# Altium project MU-RK3576J-MB.PrjPCB (part 11 of 13)

## Sheet RGMII0_ETH_PHY.SchDoc
size 420 x 297 mm; SheetNumber: 16; SheetTotal: 32; DocumentTypeShort: Э3; DocumentInvertoryNumber: ㅤ
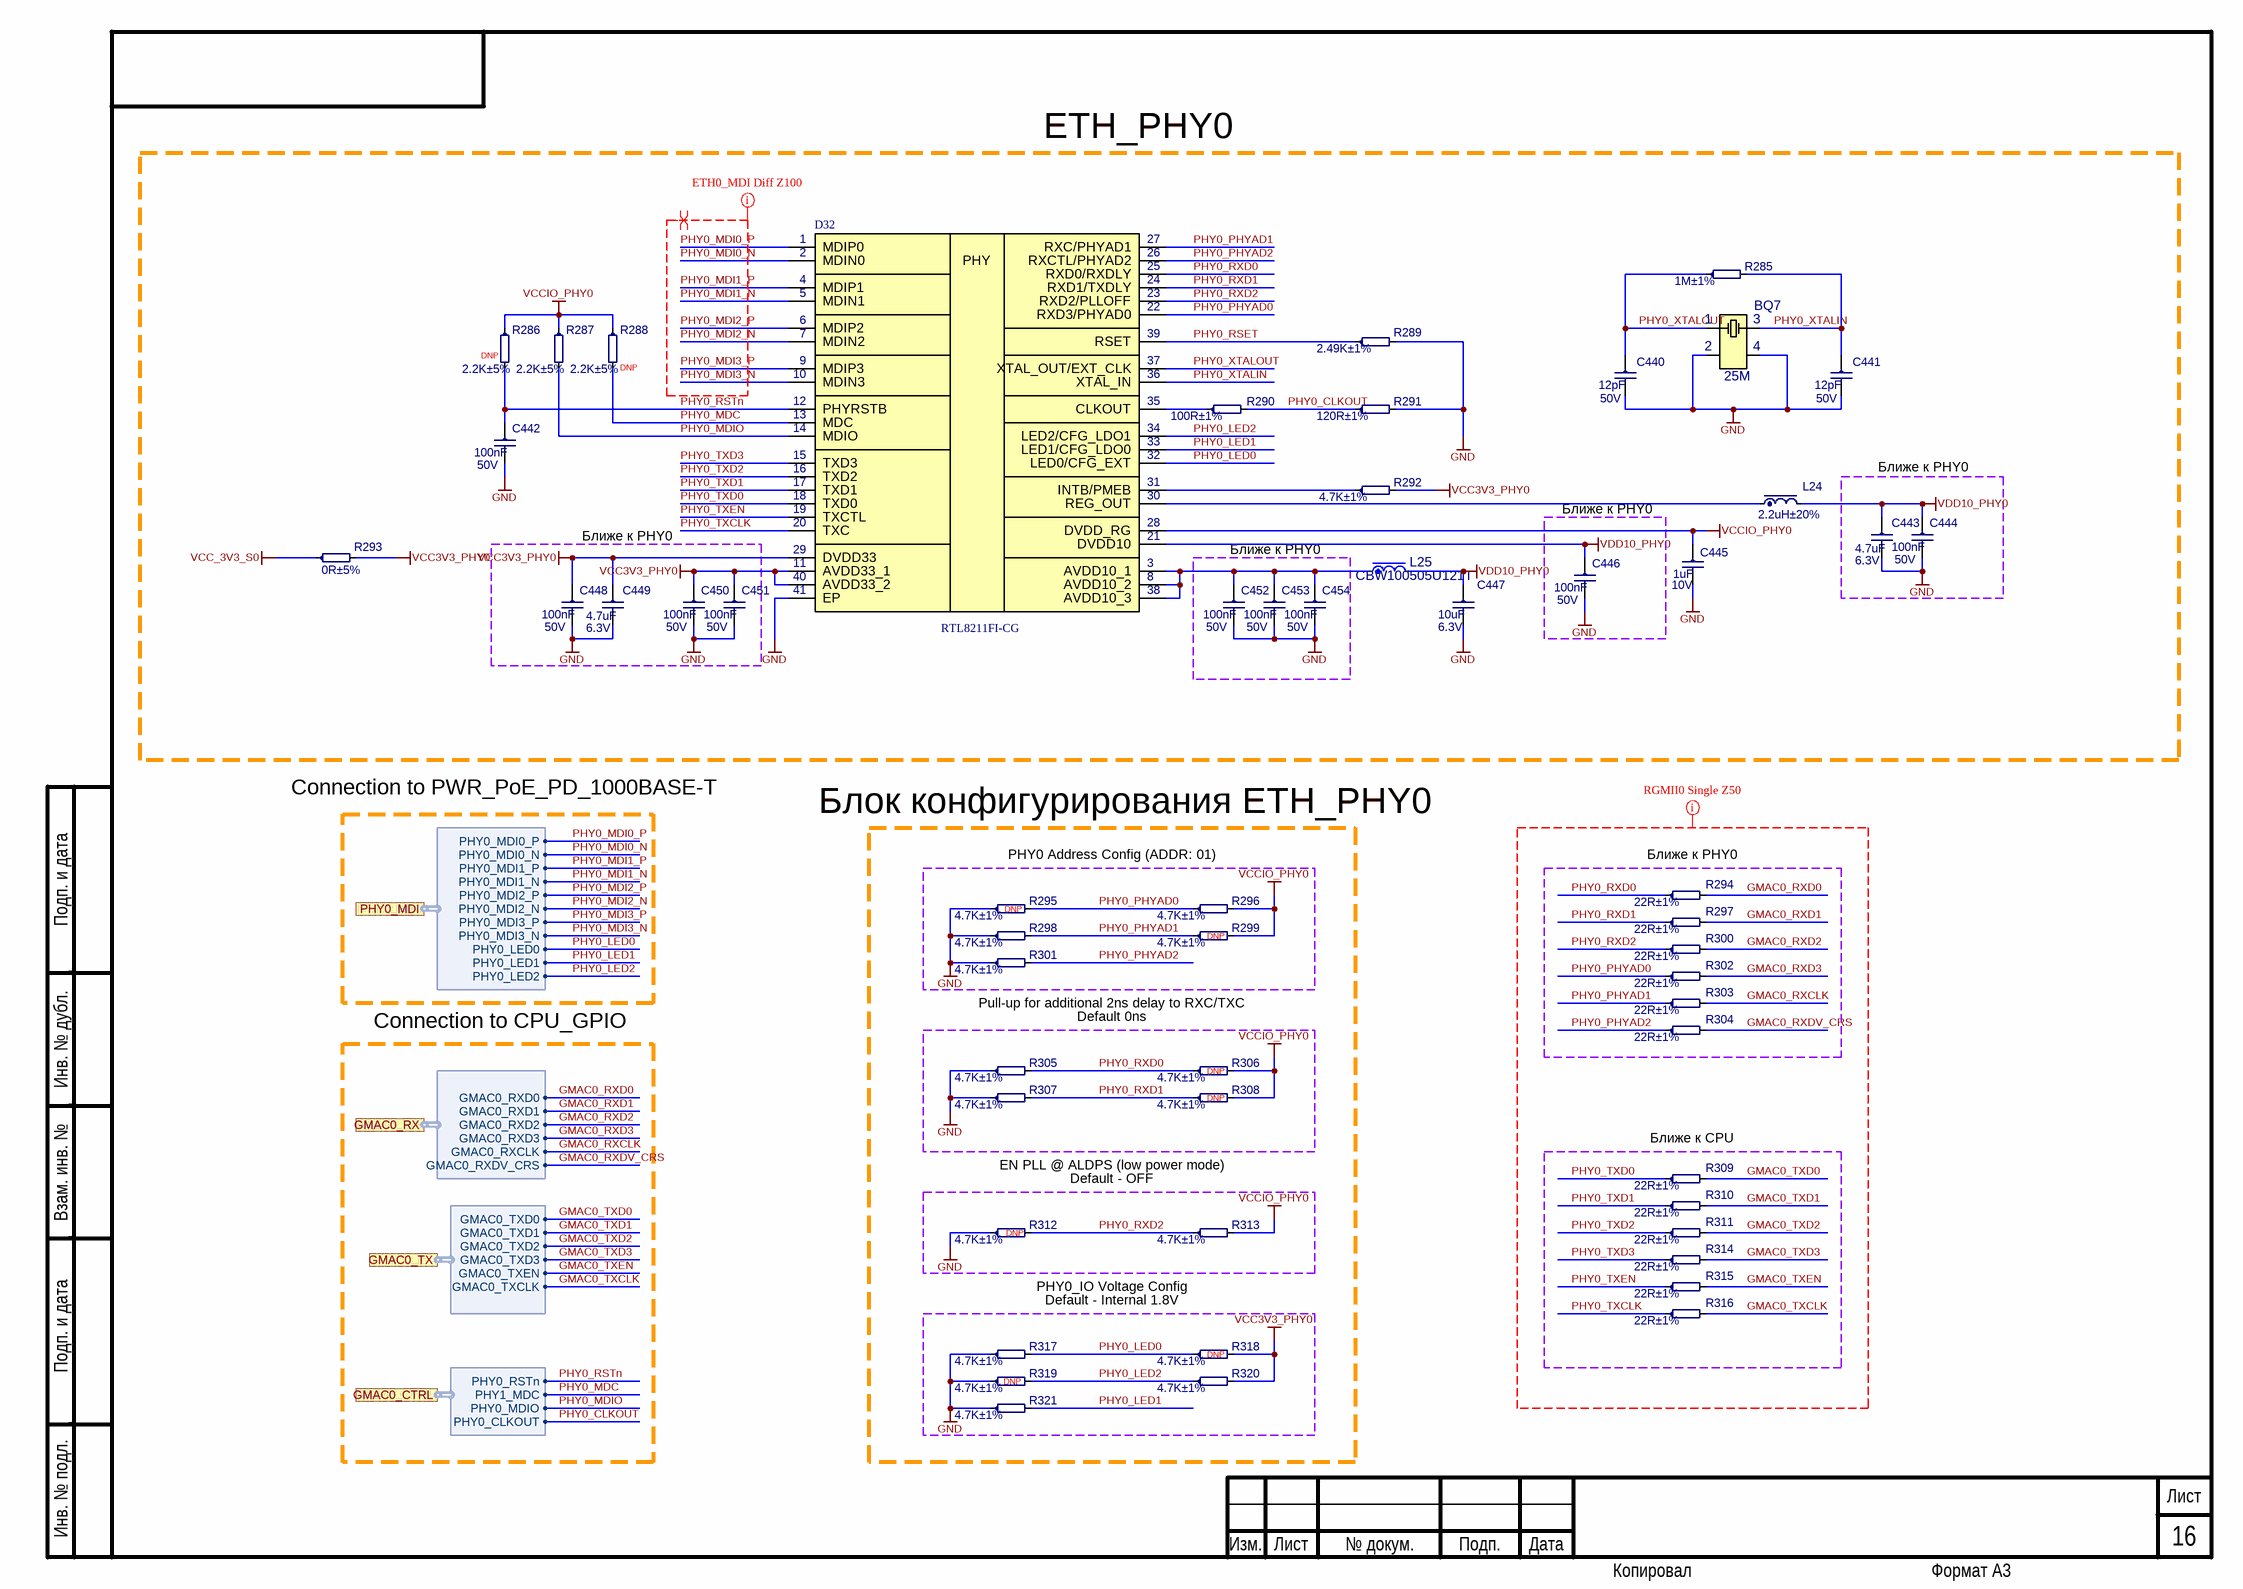
[diagram p31: RGMII0_ETH_PHY.SchDoc]

### Parts
BQ7  25M  [NX3225GA]
C440  12pF  Voltage: 50V  [C0402]
C441  12pF  Voltage: 50V  [C0402]
C442  100nF  Voltage: 50V  [C0402]
C443  4.7uF  Voltage: 6.3V  [C0402]
C444  100nF  Voltage: 50V  [C0402]
C445  1uF  Voltage: 10V  [C0402]
C446  100nF  Voltage: 50V  [C0402]
C447  10uF  Voltage: 6.3V  [C0402]
C448  100nF  Voltage: 50V  [C0402]
C449  4.7uF  Voltage: 6.3V  [C0402]
C450  100nF  Voltage: 50V  [C0402]
C451  100nF  Voltage: 50V  [C0402]
C452  100nF  Voltage: 50V  [C0402]
C453  100nF  Voltage: 50V  [C0402]
C454  100nF  Voltage: 50V  [C0402]
D32  RTL8211FI-CG  [RTL8211F-CG]
L24  2.2uH±20%  [L0806]
L25  CBW100505U121T  [L0402]
R285  1M±1%  [R0402]
R286  2.2K±5%  [R0402]
R287  2.2K±5%  [R0402]
R288  2.2K±5%  [R0402]
R289  2.49K±1%  [R0402]
R290  100R±1%  [R0402]
R291  120R±1%  [R0402]
R292  4.7K±1%  [R0402]
R293  0R±5%  [R0805]
R294  22R±1%  [R0402]
R295  4.7K±1%  [R0402]
R296  4.7K±1%  [R0402]
R297  22R±1%  [R0402]
R298  4.7K±1%  [R0402]
R299  4.7K±1%  [R0402]
R300  22R±1%  [R0402]
R301  4.7K±1%  [R0402]
R302  22R±1%  [R0402]
R303  22R±1%  [R0402]
R304  22R±1%  [R0402]
R305  4.7K±1%  [R0402]
R306  4.7K±1%  [R0402]
R307  4.7K±1%  [R0402]
R308  4.7K±1%  [R0402]
R309  22R±1%  [R0402]
R310  22R±1%  [R0402]
R311  22R±1%  [R0402]
R312  4.7K±1%  [R0402]
R313  4.7K±1%  [R0402]
R314  22R±1%  [R0402]
R315  22R±1%  [R0402]
R316  22R±1%  [R0402]
R317  4.7K±1%  [R0402]
R318  4.7K±1%  [R0402]
R319  4.7K±1%  [R0402]
R320  4.7K±1%  [R0402]
R321  4.7K±1%  [R0402]

### Blocks framed on the sheet
Ближе к PHY0: C446
Ближе к PHY0: C443 C444
Ближе к PHY0: C448-C451
Ближе к PHY0: C452-C454
PHY0 Address Config (ADDR: 01): R295 R296 R298 R299 R301
Ближе к PHY0: R294 R297 R300 R302-R304
Default 0ns: R305-R308
Ближе к CPU: R309-R311 R314-R316
Default - OFF: R312 R313
Default - Internal 1.8V: R317-R321

### Ports
GMAC0_CTRL (harness GMAC0_CTRL), GMAC0_RX (harness GMAC0_RX), GMAC0_TX (harness GMAC0_TX), PHY0_MDI (harness PHY0_MDI)

### Harnesses
GMAC0_RX: GMAC0_RXD1, GMAC0_RXD2, GMAC0_RXD3, GMAC0_RXD0, GMAC0_RXCLK, GMAC0_RXDV_CRS
GMAC0_TX: GMAC0_TXD1, GMAC0_TXD2, GMAC0_TXD3, GMAC0_TXD0, GMAC0_TXEN, GMAC0_TXCLK
GMAC0_CTRL: PHY0_RSTn, PHY1_MDC, PHY0_MDIO, PHY0_CLKOUT
PHY0_MDI: PHY0_MDI0_N, PHY0_MDI1_P, PHY0_MDI1_N, PHY0_MDI2_P, PHY0_MDI0_P, PHY0_MDI2_N, PHY0_MDI3_P, PHY0_MDI3_N, PHY0_LED0, PHY0_LED1, PHY0_LED2

### Nets
GND: BQ7.2 BQ7.4 C440.2 C441.2 C442.2 C443.2 C444.2 C445.2 C446.2 C447.2 C448.2 C449.2 C450.2 C451.2 C452.2 C453.2 C454.2 D32.41(EP) R289.2 R291.2 R295.1 R298.1 R301.1 R305.1 R307.1 R312.1 R317.1 R319.1 R321.1
VCC3V3_PHY0: C448.1 C449.1 C450.1 C451.1 D32.11(AVDD33_1) D32.29(DVDD33) D32.40(AVDD33_2) R292.2 R293.2 R318.2 R320.2
VCC_3V3_S0: R293.1
VCCIO_PHY0: C445.1 D32.28(DVDD_RG) R286.1 R287.1 R288.1 R296.2 R299.2 R306.2 R308.2 R313.2
VDD10_PHY0: C443.1 C444.1 C446.1 C447.1 D32.21(DVDD10) L24.2 L25.2
GMAC0_RXCLK: R303.2 ; port GMAC0_RX.GMAC0_RXCLK
GMAC0_RXD0: R294.2 ; port GMAC0_RX.GMAC0_RXD0
GMAC0_RXD1: R297.2 ; port GMAC0_RX.GMAC0_RXD1
GMAC0_RXD2: R300.2 ; port GMAC0_RX.GMAC0_RXD2
GMAC0_RXD3: R302.2 ; port GMAC0_RX.GMAC0_RXD3
GMAC0_RXDV_CRS: R304.2 ; port GMAC0_RX.GMAC0_RXDV_CRS
GMAC0_TXCLK: R316.2 ; port GMAC0_TX.GMAC0_TXCLK
GMAC0_TXD0: R309.2 ; port GMAC0_TX.GMAC0_TXD0
GMAC0_TXD1: R310.2 ; port GMAC0_TX.GMAC0_TXD1
GMAC0_TXD2: R311.2 ; port GMAC0_TX.GMAC0_TXD2
GMAC0_TXD3: R314.2 ; port GMAC0_TX.GMAC0_TXD3
GMAC0_TXEN: R315.2 ; port GMAC0_TX.GMAC0_TXEN
PHY0_CLKOUT: R290.2 R291.1 ; port GMAC0_CTRL.PHY0_CLKOUT
PHY0_LED0: D32.32(LED0/CFG_EXT) R317.2 R318.1 ; port PHY0_MDI.PHY0_LED0
PHY0_LED1: D32.33(LED1/CFG_LDO0) R321.2 ; port PHY0_MDI.PHY0_LED1
PHY0_LED2: D32.34(LED2/CFG_LDO1) R319.2 R320.1 ; port PHY0_MDI.PHY0_LED2
PHY0_MDC: D32.13(MDC) R288.2 ; port GMAC0_CTRL.PHY1_MDC
PHY0_MDI0_N: D32.2(MDIN0) ; port PHY0_MDI.PHY0_MDI0_N  [project net PHY0_MDI.PHY0_MDI0_N]
PHY0_MDI0_P: D32.1(MDIP0) ; port PHY0_MDI.PHY0_MDI0_P  [project net PHY0_MDI.PHY0_MDI0_P]
PHY0_MDI1_N: D32.5(MDIN1) ; port PHY0_MDI.PHY0_MDI1_N  [project net PHY0_MDI.PHY0_MDI1_N]
PHY0_MDI1_P: D32.4(MDIP1) ; port PHY0_MDI.PHY0_MDI1_P  [project net PHY0_MDI.PHY0_MDI1_P]
PHY0_MDI2_N: D32.7(MDIN2) ; port PHY0_MDI.PHY0_MDI2_N  [project net PHY0_MDI.PHY0_MDI2_N]
PHY0_MDI2_P: D32.6(MDIP2) ; port PHY0_MDI.PHY0_MDI2_P  [project net PHY0_MDI.PHY0_MDI2_P]
PHY0_MDI3_N: D32.10(MDIN3) ; port PHY0_MDI.PHY0_MDI3_N  [project net PHY0_MDI.PHY0_MDI3_N]
PHY0_MDI3_P: D32.9(MDIP3) ; port PHY0_MDI.PHY0_MDI3_P  [project net PHY0_MDI.PHY0_MDI3_P]
PHY0_MDIO: D32.14(MDIO) R287.2 ; port GMAC0_CTRL.PHY0_MDIO
PHY0_PHYAD0: D32.22(RXD3/PHYAD0) R295.2 R296.1 R302.1
PHY0_PHYAD1: D32.27(RXC/PHYAD1) R298.2 R299.1 R303.1
PHY0_PHYAD2: D32.26(RXCTL/PHYAD2) R301.2 R304.1
PHY0_RSET: D32.39(RSET) R289.1
PHY0_RSTn: C442.1 D32.12(PHYRSTB) R286.2 ; port GMAC0_CTRL.PHY0_RSTn
PHY0_RXD0: D32.25(RXD0/RXDLY) R294.1 R305.2 R306.1
PHY0_RXD1: D32.24(RXD1/TXDLY) R297.1 R307.2 R308.1
PHY0_RXD2: D32.23(RXD2/PLLOFF) R300.1 R312.2 R313.1
PHY0_TXCLK: D32.20(TXC) R316.1
PHY0_TXD0: D32.18(TXD0) R309.1
PHY0_TXD1: D32.17(TXD1) R310.1
PHY0_TXD2: D32.16(TXD2) R311.1
PHY0_TXD3: D32.15(TXD3) R314.1
PHY0_TXEN: D32.19(TXCTL) R315.1
PHY0_XTALIN: BQ7.3 C441.1 D32.36(XTAL_IN) R285.2
PHY0_XTALOUT: BQ7.1 C440.1 D32.37(XTAL_OUT/EXT_CLK) R285.1
NetC452_1: C452.1 C453.1 C454.1 D32.3(AVDD10_1) D32.8(AVDD10_2) D32.38(AVDD10_3) L25.1
NetD32_30: D32.30(REG_OUT) L24.1
NetD32_31: D32.31(INTB/PMEB) R292.1
NetD32_35: D32.35(CLKOUT) R290.1

### Layout directives
net class ETH0_MDI: PHY0_MDI0_N, PHY0_MDI0_P, PHY0_MDI1_N, PHY0_MDI1_P, PHY0_MDI2_N, PHY0_MDI2_P, PHY0_MDI3_N, PHY0_MDI3_P
net class RGMII0: GMAC0_RXCLK, GMAC0_RXD0, GMAC0_RXD1, GMAC0_RXD2, GMAC0_RXD3, GMAC0_RXDV_CRS, GMAC0_TXCLK, GMAC0_TXD0, GMAC0_TXD1, GMAC0_TXD2, GMAC0_TXD3, GMAC0_TXEN, PHY0_PHYAD0, PHY0_PHYAD1, PHY0_PHYAD2, PHY0_RXD0, PHY0_RXD1, PHY0_RXD2, PHY0_TXCLK, PHY0_TXD0, PHY0_TXD1, PHY0_TXD2, PHY0_TXD3, PHY0_TXEN
differential pair; differential pair class Diff_Z100: PHY0_MDI0_N, PHY0_MDI0_P, PHY0_MDI1_N, PHY0_MDI1_P, PHY0_MDI2_N, PHY0_MDI2_P, PHY0_MDI3_N, PHY0_MDI3_P

### Notes on the sheet
- ETH_PHY0
- (near R286) DNP
- (near R288) DNP
- Connection to PWR_PoE_PD_1000BASE-T
- Блок конфигурирования ETH_PHY0
- (near R295) DNP
- (near R299) DNP
- (near R301) Pull-up for additional 2ns delay to RXC/TXC
- Connection to CPU_GPIO
- (near R306) DNP
- (near R308) DNP
- EN PLL @ ALDPS (low power mode)
- (near R312) DNP
- PHY0_IO Voltage Config
- (near R319) DNP
- (near R318) DNP
- Подп. и дата
- Инв. № дубл.
- Взам. инв. №
- Инв. № подл.
- Изм.
- Лист
- № докум.
- Подп.
- Дата
- Копировал
- Формат А3
- (in symbol RTL8211F-CG) PHY

### Library data of the parts
BQ7 = E3SB25E00000DE: 25MHz 10pF ±10ppm SMD3225-4P; Part Number: TAXM25M4RDBCCT2T; Manufacturer: Yajingxin; Place: S; Check: False; Value: 25M; Temperature: -40°C~85°C; Tolerance: 10ppm; NameFromManufacturer: TAXM25M4RDBCCT2T; Last changed: 18.04.2023
C440 C441 = 0402-NP0-50V-12pF±5%: as C422 on sheet BMC; Case: C0402; Part Number: 0402-NP0-50V-12pF±5%; Value: 12pF; Temperature: -55°C~125°C; ComponentLink2Description: Link to datasheet; ComponentLink1Description: DATASHEET; ComponentLink2URL: https://www.terraelectronica.ru/pdf/show?pdf_file=http%253A%252F%252Fwww.farnell.com%252Fdatasheets%252F2048662.pdf; ComponentLink1URL: Datasheets/capacitors/GRM1555C1H120JA01-01A.pdf; Last changed: 27.10.2022
C442 C444 C446 C448 C450-C454 = 0402-X7R-50V-0.1uF±10%: Ceramic Capacitor 0402 100nF ±10% 50V X7R; Manufacturer: Yageo; NameFromManufacturer: CC0402KRX7R9BB104; Place: *); Check: False; Dielectric: X7R; Case: C0402; Part Number: 0402-X7R-50V-0.1uF±10%; Value: 100nF; Tolerance: 10%; Temperature: -55°C~125°C; ComponentLink2Description: Link to datasheet; ComponentLink1Description: DATASHEET; ComponentLink2URL: https://www.lcsc.com/product-detail/Multilayer-Ceramic-Capacitors-MLCC-SMD-SMT_YAGEO-CC0402KRX7R9BB104_C131394.html; Last changed: 09.04.2025
C443 C449 = 0402-X5R-6.3V-4.7uF±20%: Ceramic Capacitor 0402 4.7uF ±20% 6.3V X5R; Manufacturer: Yageo; NameFromManufacturer: CC0402MRX5R5BB475; Place: *); Check: False; Dielectric: X5R; Case: C0402; Part Number: 0402-X5R-6.3V-4.7uF±20%; Value: 4.7uF; Tolerance: 20%; Temperature: -55°C~125°C; ComponentLink2Description: Link to datasheet; ComponentLink1Description: DATASHEET; ComponentLink2URL: https://ru.mouser.com/ProductDetail/YAGEO/CC0402MRX5R5BB475?qs=%2Fha2pyFadujQAk9rG2cgJpeZ0BKEEZe0MyMZqMwsns5cG502XdwDVw%3D%3D; ComponentLink1URL: Datasheets/capacitors/UPY-GPHC_X5R_4V-to-50V_27.pdf; Last changed: 27.10.2022
C445 = 0402-X5R-10V-1uF±10%: Manufacturer: Samsung; NameFromManufacturer: CL05A105KP5NNNC; Dielectric: X5R; Place: *); Tolerance: 10%; Check: False; Case: C0402; Part Number: 0402-X5R-10V-1uF±10%; Value: 1uF; Temperature: -55°C~85°C; ComponentLink2Description: Link to datasheet; ComponentLink1Description: DATASHEET; ComponentLink2URL: https://datasheet.ciiva.com/15195/getdatasheetpartid-358390-15195630.pdf?src-supplier=Verical; ComponentLink1URL: Datasheets/capacitors/getdatasheetpartid-358390-15195630.pdf; Last changed: 27.10.2022
C447 = 0402-X5R-6.3V-10uF±20%: Manufacturer: Yageo; NameFromManufacturer: CC0402MRX5R5BB106; Dielectric: X5R; Place: *); Tolerance: 20%; Check: False; Case: C0402; Part Number: 0402-X5R-6.3V-10uF±20%; Value: 10uF; Temperature: -55°C~125°C; ComponentLink2Description: Link to datasheet; ComponentLink1Description: DATASHEET; ComponentLink2URL: https://ru.mouser.com/ProductDetail/YAGEO/CC0402MRX5R5BB106?qs=%2Fha2pyFadujQAk9rG2cgJj8l7IbODD3KVaDjvxAcKzu9LtlLnRlq6Q%3D%3D; ComponentLink1URL: Datasheets/capacitors/UPY-GPHC_X5R_4V-to-50V_27.pdf; Last changed: 27.10.2022
D32 = RTL8211F-CG: Phy 1-CH 10MBPS/100MBPS/1GBPS 3.3V 40-PIN QFN; Manufacturer: Realtek Semicon; Check: False; Part Number: RTL8211FI-CG; Value: RTL8211FI-CG; NameFromManufacturer: RTL8211FI-CG; ComponentLink1Description: DATASHEET; Last changed: 24.03.2023
L24 = 0806-2.1A-15uH±20%: Manufacturer: Murata Electronics; NameFromManufacturer: DFE201612E-2R2M=P2; Current: 2.1A; Place: *); Value: 2.2uH; Tolerance: 20%; DC Resistance: 0.116R; Check: False; Case: XXXX; Part Number: 0806-2.1A-15uH±20%; Temperature: -55°C~125°C; ComponentLink1Description: DATASHEET; ComponentLink1URL: https://www.terraelectronica.ru/product/3410097; Datasheet: Datasheets/inductors/J(E)TE243A-0006.pdf; Last changed: 27.10.2022
L25 = BLM15EG121SN1D: 120Ω@100MHz  Ferrite Beads; Manufacturer: Murata Electronics; Place: S; Tolerance: 25%; DC Resistance: 0.095R; Check: False; Analog: UPZ1005D121-1R3TF, CBW100505U121T, BLM15EG121SN1D; Part Number: CBW100505U121T; Value: CBW100505U121T; Temperature: -40°C~85°C; NameFromManufacturer: CBW100505U121T; Last changed: 18.04.2023
R285 = 0402-0.0625W-1M-100ppm±1%: as R253 on sheet BMC; Case: R0402; Part Number: 0402-0.0625W-1M-100ppm±1%; Tolerance: 1%; Temperature: -55°C~155°C; ComponentLink1Description: DATASHEET; ComponentLink1URL: https://www.yageo.com/upload/media/product/productsearch/datasheet/rchip/PYu-RC_Group_51_RoHS_L_11.pdf; Datasheet: Datasheets/resistors/PYu-RC_Group_51_RoHS_L_11.pdf; Last changed: 27.10.2022
R286-R288 = 0402-0.0625W-2.2K-100ppm±5%: *; NameFromManufacturer: RC0402JR-072K2L; Manufacturer: Yageo; Place: *); Value: 2.2K; Tolerance: 5%; Check: False; Case: R0402; Part Number: 0402-0.0625W-2.2K-100ppm±5%; Temperature: -55°C~155°C; ComponentLink1Description: DATASHEET; ComponentLink1URL: https://octopart.com/ac0402jr-072k2l-yageo-23514430?r=sp; Datasheet: Datasheets/resistors/PYu-AC_51_RoHS_L_8.pdf; Last changed: 27.10.2022
R289 = 0402-0.0625W-2.49K-100ppm±1%: Chip Resistor 0402 2.49kΩ ±1% 50V ±100ppm/℃ Thick Film; NameFromManufacturer: RC0402FR-072K49L; Manufacturer: Yageo; Place: *); Value: 2.49K; Check: False; Case: R0402; Part Number: 0402-0.0625W-2.49K-100ppm±1%; Tolerance: 1%; Temperature: -55°C~155°C; ComponentLink1Description: DATASHEET; ComponentLink1URL: https://www.electronshik.ru/item/YAG/RC0402FR-072K49L; Datasheet: Datasheets/resistors/PYu-RC_Group_51_RoHS_L_12.pdf; Last changed: 27.10.2022
R290 = 0402-0.0625W-100R-100ppm±1%: Chip Resistor 0402 100Ω ±1% 50V ±100ppm/℃ Thick Film; NameFromManufacturer: RC0402FR-07100RL; Manufacturer: Yageo; Place: *); Value: 100R; Check: False; Case: R0402; Part Number: 0402-0.0625W-100R-100ppm±1%; Tolerance: 1%; Temperature: -55°C~155°C; ComponentLink1Description: DATASHEET; ComponentLink1URL: https://www.yageo.com/upload/media/product/productsearch/datasheet/rchip/PYu-RC_Group_51_RoHS_L_11.pdf; Datasheet: Datasheets/resistors/PYu-RC_Group_51_RoHS_L_11.pdf; Last changed: 27.10.2022
R291 = 0402-0.0625W-120R-100ppm±1%: NameFromManufacturer: RC0402FR-07120RL; Manufacturer: Yageo; Place: *); Value: 120R; Tolerance: 1%; Check: False; Case: R0402; Part Number: 0402-0.0625W-120R-100ppm±1%; Temperature: -55°C~155°C; ComponentLink1Description: DATASHEET; ComponentLink1URL: https://www.electronshik.ru/item/YAG/RC0402FR-07120RL; Datasheet: chrome-extension://efaidnbmnnnibpcajpcglclefindmkaj/https://data.electronshik.ru/z/Datasheet/R/RC0402.pdf##; Last changed: 03.04.2023
R292 R295 R296 R298 R299 R301 R305-R308 R312 R313 R317-R321 = 0402-0.0625W-4.7K-100ppm±1%: NameFromManufacturer: RC0402FR-074K7L; Manufacturer: Yageo; Place: *); Value: 4.7K; Tolerance: 1%; Check: False; Case: R0402; Part Number: 0402-0.0625W-4.7K-100ppm±1%; Temperature: -55°C~155°C; ComponentLink1Description: DATASHEET; ComponentLink1URL: https://www.promelec.ru/product/229739/; Datasheet: Datasheets/resistors/PYu-RC_Group_51_RoHS_L_11.pdf; Last changed: 11.11.2022
R293 = 0805-0.125W-0R-250ppm±5%: NameFromManufacturer: RC0805JR-070RL; Manufacturer: Yageo; Place: *); Value: 0R; Tolerance: 5%; Check: False; Case: R0805; Part Number: 0805-0.125W-0R-250ppm±5%; Temperature: -55°C~155°C; ComponentLink1Description: DATASHEET; ComponentLink1URL: https://www.terraelectronica.ru/product/327233; Datasheet: Datasheets/resistors/PYu-RC_Group_51_RoHS_L_11.pdf; Last changed: 27.10.2022
R294 R297 R300 R302-R304 R309-R311 R314-R316 = 0402-0.0625W-22R-100ppm±1%: Chip Resistor 0402 22Ω ±1% 50V ±100ppm/℃ Thick Film; NameFromManufacturer: RC0402FR-0722RL; Manufacturer: Yageo; Place: *); Value: 22R; Check: False; Case: R0402; Part Number: 0402-0.0625W-22R-100ppm±1%; Tolerance: 1%; Temperature: -55°C~155°C; ComponentLink1Description: DATASHEET; ComponentLink1URL: https://www.yageo.com/upload/media/product/productsearch/datasheet/rchip/PYu-RC_Group_51_RoHS_L_11.pdf; Datasheet: Datasheets/resistors/PYu-RC_Group_51_RoHS_L_11.pdf; Last changed: 27.10.2022

## Sheet CPU_ETH_RGMII1_SW.SchDoc
size 420 x 297 mm; SheetNumber: 17; SheetTotal: 32; DocumentTypeShort: Э3; DocumentInvertoryNumber: ㅤ
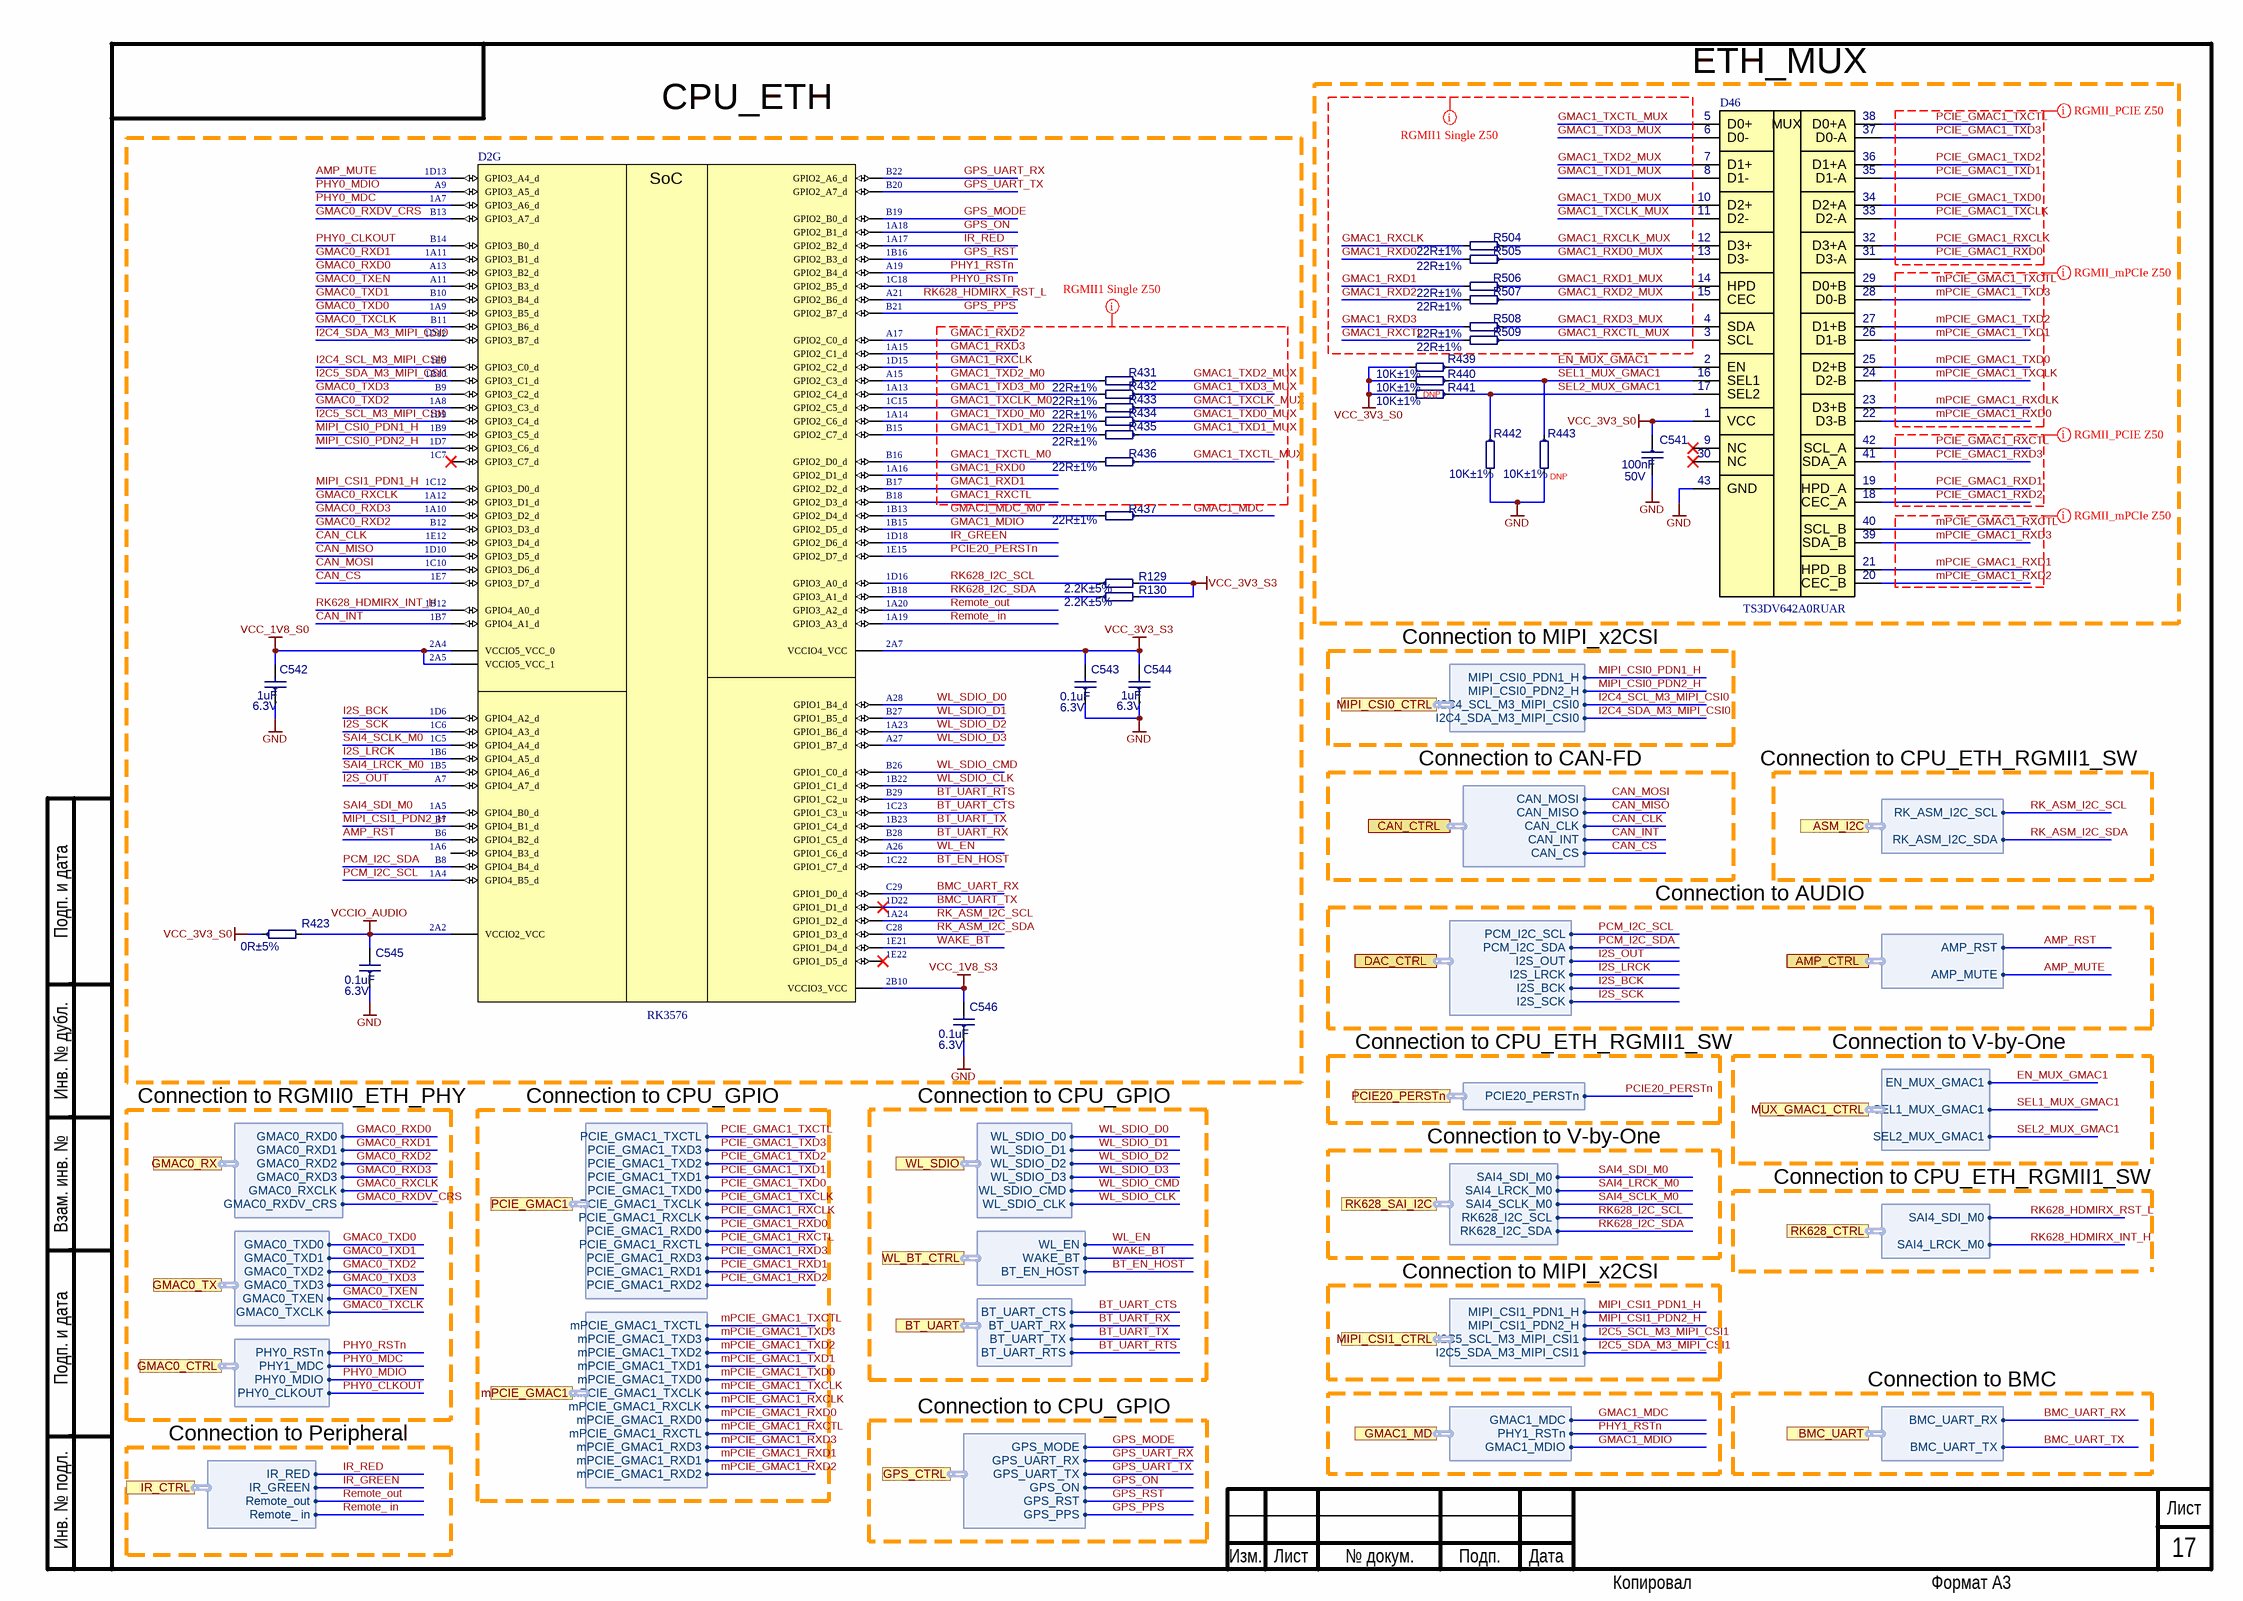
[diagram p32: CPU_ETH_RGMII1_SW.SchDoc]

### Parts
C541  100nF  Voltage: 50V  [C0402]
C542  1uF  Voltage: 6.3V  [C0201]
C543  0.1uF  Voltage: 6.3V  [C0201]
C544  1uF  Voltage: 6.3V  [C0201]
C545  0.1uF  Voltage: 6.3V  [C0201]
C546  0.1uF  Voltage: 6.3V  [C0201]
D2  RK3576  [BGAFCCSP698L]  (part G of 7)
D46  TS3DV642A0RUAR  [TS3DV642A0RUAR]
R129  2.2K±5%  [R0402]
R130  2.2K±5%  [R0402]
R423  0R±5%  [R0402]
R431  22R±1%  [R0402]
R432  22R±1%  [R0402]
R433  22R±1%  [R0402]
R434  22R±1%  [R0402]
R435  22R±1%  [R0402]
R436  22R±1%  [R0402]
R437  22R±1%  [R0402]
R439  10K±1%  [R0402]
R440  10K±1%  [R0402]
R441  10K±1%  [R0402]
R442  10K±1%  [R0402]
R443  10K±1%  [R0402]
R504  22R±1%  [R0402]
R505  22R±1%  [R0402]
R506  22R±1%  [R0402]
R507  22R±1%  [R0402]
R508  22R±1%  [R0402]
R509  22R±1%  [R0402]

### Ports
AMP_CTRL (harness AMP_CTRL), ASM_I2C (harness ASM_I2C), BMC_UART (harness BMC_UART), BT_UART (harness BT_UART), CAN_CTRL (harness CAN_CTRL), DAC_CTRL (harness DAC_CTRL), GMAC0_CTRL (harness GMAC0_CTRL), GMAC0_RX (harness GMAC0_RX), GMAC0_TX (harness GMAC0_TX), GMAC1_MD (harness GMAC1_MD), GPS_CTRL (harness GPS_CTRL), IR_CTRL (harness IR_CTRL), MIPI_CSI0_CTRL (harness MIPI_CSI0_CTRL), MIPI_CSI1_CTRL (harness MIPI_CSI1_CTRL), mPCIE_GMAC1 (harness mPCIE_GMAC1), MUX_GMAC1_CTRL (harness MUX_GMAC1_CTRL), PCIE20_PERSTn (harness PCIE20_PERSTn), PCIE_GMAC1 (harness PCIE_GMAC1), RK628_CTRL (harness RK628_CTRL), RK628_SAI_I2C (harness RK628_SAI_I2C), WL_BT_CTRL (harness WL_BT_CTRL), WL_SDIO (harness WL_SDIO)

### Harnesses
GMAC0_RX: GMAC0_RXD1, GMAC0_RXD2, GMAC0_RXD3, GMAC0_RXD0, GMAC0_RXCLK, GMAC0_RXDV_CRS
GMAC0_TX: GMAC0_TXD1, GMAC0_TXD2, GMAC0_TXD3, GMAC0_TXD0, GMAC0_TXEN, GMAC0_TXCLK
GMAC0_CTRL: PHY0_RSTn, PHY1_MDC, PHY0_MDIO, PHY0_CLKOUT
PCIE_GMAC1: PCIE_GMAC1_TXD3, PCIE_GMAC1_TXD2, PCIE_GMAC1_TXD1, PCIE_GMAC1_TXCTL, PCIE_GMAC1_TXD0, PCIE_GMAC1_TXCLK, PCIE_GMAC1_RXCLK, PCIE_GMAC1_RXD0, PCIE_GMAC1_RXCTL, PCIE_GMAC1_RXD3, PCIE_GMAC1_RXD1, PCIE_GMAC1_RXD2
mPCIE_GMAC1: mPCIE_GMAC1_TXD3, mPCIE_GMAC1_TXD2, mPCIE_GMAC1_TXD1, mPCIE_GMAC1_TXCTL, mPCIE_GMAC1_TXD0, mPCIE_GMAC1_TXCLK, mPCIE_GMAC1_RXCLK, mPCIE_GMAC1_RXD0, mPCIE_GMAC1_RXCTL, mPCIE_GMAC1_RXD3, mPCIE_GMAC1_RXD1, mPCIE_GMAC1_RXD2
WL_SDIO: WL_SDIO_D1, WL_SDIO_D2, WL_SDIO_D3, WL_SDIO_D0, WL_SDIO_CMD, WL_SDIO_CLK
BT_UART: BT_UART_CTS, BT_UART_RX, BT_UART_TX, BT_UART_RTS
RK628_SAI_I2C: SAI4_LRCK_M0, SAI4_SCLK_M0, SAI4_SDI_M0, RK628_I2C_SCL, RK628_I2C_SDA
MIPI_CSI1_CTRL: I2C5_SDA_M3_MIPI_CSI1, I2C5_SCL_M3_MIPI_CSI1, MIPI_CSI1_PDN2_H, MIPI_CSI1_PDN1_H
MUX_GMAC1_CTRL: SEL1_MUX_GMAC1, EN_MUX_GMAC1, SEL2_MUX_GMAC1
RK628_CTRL: SAI4_LRCK_M0, SAI4_SDI_M0
WL_BT_CTRL: WAKE_BT, WL_EN, BT_EN_HOST
GPS_CTRL: GPS_MODE, GPS_UART_TX, GPS_UART_RX, GPS_ON, GPS_RST, GPS_PPS
AMP_CTRL: AMP_MUTE, AMP_RST
DAC_CTRL: PCM_I2C_SDA, PCM_I2C_SCL, I2S_OUT, I2S_LRCK, I2S_BCK, I2S_SCK
CAN_CTRL: CAN_MISO, CAN_MOSI, CAN_CLK, CAN_INT, CAN_CS
ASM_I2C: RK_ASM_I2C_SCL, RK_ASM_I2C_SDA
BMC_UART: BMC_UART_RX, BMC_UART_TX
GMAC1_MD: GMAC1_MDC, GMAC1_MDIO, PHY1_RSTn
PCIE20_PERSTn: PCIE20_PERSTn
IR_CTRL: Remote_out, IR_GREEN, IR_RED, Remote_ in
MIPI_CSI0_CTRL: I2C4_SDA_M3_MIPI_CSI0, I2C4_SCL_M3_MIPI_CSI0, MIPI_CSI0_PDN2_H, MIPI_CSI0_PDN1_H

### Nets
GND: C541.2 C542.1 C543.1 C544.1 C545.1 C546.1 D46.43(GND) R442.2 R443.2
VCC_1V8_S0: C542.2 D2.2A4(VCCIO5_VCC_0) D2.2A5(VCCIO5_VCC_1)
VCC_1V8_S3: C546.2 D2.2B10(VCCIO3_VCC)
VCC_3V3_S0: C541.1 D46.1(VCC) R423.1 R439.2 R440.2 R441.2
VCC_3V3_S3: C543.2 C544.2 D2.2A7(VCCIO4_VCC) R129.2 R130.2
VCCIO_AUDIO: C545.2 D2.2A2(VCCIO2_VCC) R423.2
AMP_MUTE: D2.1D13(GPIO3_A4_d) ; port AMP_CTRL.AMP_MUTE  [project net AMP_CTRL.AMP_MUTE]
AMP_RST: D2.B6(GPIO4_B2_d) ; port AMP_CTRL.AMP_RST  [project net AMP_CTRL.AMP_RST]
BMC_UART_RX: D2.C29(GPIO1_D0_d) ; port BMC_UART.BMC_UART_RX  [project net BMC_UART.BMC_UART_RX]
BMC_UART_TX: D2.1D22(GPIO1_D1_d) ; port BMC_UART.BMC_UART_TX  [project net BMC_UART.BMC_UART_TX]
BT_EN_HOST: D2.1C22(GPIO1_C7_d) ; port WL_BT_CTRL.BT_EN_HOST
BT_UART_CTS: D2.1C23(GPIO1_C3_u) ; port BT_UART.BT_UART_CTS  [project net BT_UART.BT_UART_CTS]
BT_UART_RTS: D2.B29(GPIO1_C2_u) ; port BT_UART.BT_UART_RTS  [project net BT_UART.BT_UART_RTS]
BT_UART_RX: D2.B28(GPIO1_C5_d) ; port BT_UART.BT_UART_RX  [project net BT_UART.BT_UART_RX]
BT_UART_TX: D2.1B23(GPIO1_C4_d) ; port BT_UART.BT_UART_TX  [project net BT_UART.BT_UART_TX]
CAN_CLK: D2.1E12(GPIO3_D4_d) ; port CAN_CTRL.CAN_CLK
CAN_CS: D2.1E7(GPIO3_D7_d) ; port CAN_CTRL.CAN_CS
CAN_INT: D2.1B7(GPIO4_A1_d) ; port CAN_CTRL.CAN_INT  [project net CAN_CTRL.CAN_INT]
CAN_MISO: D2.1D10(GPIO3_D5_d) ; port CAN_CTRL.CAN_MISO  [project net CAN_CTRL.CAN_MISO]
CAN_MOSI: D2.1C10(GPIO3_D6_d) ; port CAN_CTRL.CAN_MOSI  [project net CAN_CTRL.CAN_MOSI]
EN_MUX_GMAC1: D46.2(EN) R439.1 ; port MUX_GMAC1_CTRL.EN_MUX_GMAC1
GMAC0_RXCLK: D2.1A12(GPIO3_D1_d) ; port GMAC0_RX.GMAC0_RXCLK
GMAC0_RXD0: D2.A13(GPIO3_B2_d) ; port GMAC0_RX.GMAC0_RXD0
GMAC0_RXD1: D2.1A11(GPIO3_B1_d) ; port GMAC0_RX.GMAC0_RXD1
GMAC0_RXD2: D2.B12(GPIO3_D3_d) ; port GMAC0_RX.GMAC0_RXD2
GMAC0_RXD3: D2.1A10(GPIO3_D2_d) ; port GMAC0_RX.GMAC0_RXD3
GMAC0_RXDV_CRS: D2.B13(GPIO3_A7_d) ; port GMAC0_RX.GMAC0_RXDV_CRS
GMAC0_TXCLK: D2.B11(GPIO3_B6_d) ; port GMAC0_TX.GMAC0_TXCLK
GMAC0_TXD0: D2.1A9(GPIO3_B5_d) ; port GMAC0_TX.GMAC0_TXD0
GMAC0_TXD1: D2.B10(GPIO3_B4_d) ; port GMAC0_TX.GMAC0_TXD1
GMAC0_TXD2: D2.1A8(GPIO3_C3_d) ; port GMAC0_TX.GMAC0_TXD2
GMAC0_TXD3: D2.B9(GPIO3_C2_d) ; port GMAC0_TX.GMAC0_TXD3
GMAC0_TXEN: D2.A11(GPIO3_B3_d) ; port GMAC0_TX.GMAC0_TXEN
GMAC1_MDC: R437.1 ; port GMAC1_MD.GMAC1_MDC  [project net GMAC1_MD.GMAC1_MDC]
GMAC1_MDC_M0: D2.1B13(GPIO2_D4_d) R437.2
GMAC1_MDIO: D2.1B15(GPIO2_D5_d) ; port GMAC1_MD.GMAC1_MDIO  [project net GMAC1_MD.GMAC1_MDIO]
GMAC1_RXCLK: D2.1D15(GPIO2_C2_d) R504.2
GMAC1_RXCLK_MUX: D46.12(D3+) R504.1
GMAC1_RXCTL: D2.B18(GPIO2_D3_d) R509.2
GMAC1_RXCTL_MUX: D46.3(SCL) R509.1
GMAC1_RXD0: D2.1A16(GPIO2_D1_d) R505.2
GMAC1_RXD0_MUX: D46.13(D3-) R505.1
GMAC1_RXD1: D2.B17(GPIO2_D2_d) R506.2
GMAC1_RXD1_MUX: D46.14(HPD) R506.1
GMAC1_RXD2: D2.A17(GPIO2_C0_d) R507.2
GMAC1_RXD2_MUX: D46.15(CEC) R507.1
GMAC1_RXD3: D2.1A15(GPIO2_C1_d) R508.2
GMAC1_RXD3_MUX: D46.4(SDA) R508.1
GMAC1_TXCLK_M0: D2.1C15(GPIO2_C5_d) R433.2
GMAC1_TXCLK_MUX: D46.11(D2-) R433.1
GMAC1_TXCTL_M0: D2.B16(GPIO2_D0_d) R436.2
GMAC1_TXCTL_MUX: D46.5(D0+) R436.1
GMAC1_TXD0_M0: D2.1A14(GPIO2_C6_d) R434.2
GMAC1_TXD0_MUX: D46.10(D2+) R434.1
GMAC1_TXD1_M0: D2.B15(GPIO2_C7_d) R435.2
GMAC1_TXD1_MUX: D46.8(D1-) R435.1
GMAC1_TXD2_M0: D2.A15(GPIO2_C3_d) R431.2
GMAC1_TXD2_MUX: D46.7(D1+) R431.1
GMAC1_TXD3_M0: D2.1A13(GPIO2_C4_d) R432.2
GMAC1_TXD3_MUX: D46.6(D0-) R432.1
GPS_MODE: D2.B19(GPIO2_B0_d) ; port GPS_CTRL.GPS_MODE  [project net GPS_CTRL.GPS_MODE]
GPS_ON: D2.1A18(GPIO2_B1_d) ; port GPS_CTRL.GPS_ON  [project net GPS_CTRL.GPS_ON]
GPS_PPS: D2.B21(GPIO2_B7_d) ; port GPS_CTRL.GPS_PPS  [project net GPS_CTRL.GPS_PPS]
GPS_RST: D2.1B16(GPIO2_B3_d) ; port GPS_CTRL.GPS_RST  [project net GPS_CTRL.GPS_RST]
GPS_UART_RX: D2.B22(GPIO2_A6_d) ; port GPS_CTRL.GPS_UART_RX  [project net GPS_CTRL.GPS_UART_RX]
GPS_UART_TX: D2.B20(GPIO2_A7_d) ; port GPS_CTRL.GPS_UART_TX  [project net GPS_CTRL.GPS_UART_TX]
I2C4_SCL_M3_MIPI_CSI0: D2.1E9(GPIO3_C0_d) ; port MIPI_CSI0_CTRL.I2C4_SCL_M3_MIPI_CSI0
I2C4_SDA_M3_MIPI_CSI0: D2.1D12(GPIO3_B7_d) ; port MIPI_CSI0_CTRL.I2C4_SDA_M3_MIPI_CSI0
I2C5_SCL_M3_MIPI_CSI1: D2.1D9(GPIO3_C4_d) ; port MIPI_CSI1_CTRL.I2C5_SCL_M3_MIPI_CSI1
I2C5_SDA_M3_MIPI_CSI1: D2.1B10(GPIO3_C1_d) ; port MIPI_CSI1_CTRL.I2C5_SDA_M3_MIPI_CSI1
I2S_BCK: D2.1D6(GPIO4_A2_d) ; port DAC_CTRL.I2S_BCK  [project net DAC_CTRL.I2S_BCK]
I2S_LRCK: D2.1B6(GPIO4_A5_d) ; port DAC_CTRL.I2S_LRCK  [project net DAC_CTRL.I2S_LRCK]
I2S_OUT: D2.A7(GPIO4_A7_d) ; port DAC_CTRL.I2S_OUT  [project net DAC_CTRL.I2S_OUT]
I2S_SCK: D2.1C6(GPIO4_A3_d) ; port DAC_CTRL.I2S_SCK  [project net DAC_CTRL.I2S_SCK]
IR_GREEN: D2.1D18(GPIO2_D6_d) ; port IR_CTRL.IR_GREEN  [project net IR_CTRL.IR_GREEN]
IR_RED: D2.1A17(GPIO2_B2_d) ; port IR_CTRL.IR_RED  [project net IR_CTRL.IR_RED]
MIPI_CSI0_PDN1_H: D2.1B9(GPIO3_C5_d) ; port MIPI_CSI0_CTRL.MIPI_CSI0_PDN1_H  [project net MIPI_CSI0_CTRL.MIPI_CSI0_PDN1_H]
MIPI_CSI0_PDN2_H: D2.1D7(GPIO3_C6_d) ; port MIPI_CSI0_CTRL.MIPI_CSI0_PDN2_H  [project net MIPI_CSI0_CTRL.MIPI_CSI0_PDN2_H]
MIPI_CSI1_PDN1_H: D2.1C12(GPIO3_D0_d) ; port MIPI_CSI1_CTRL.MIPI_CSI1_PDN1_H  [project net MIPI_CSI1_CTRL.MIPI_CSI1_PDN1_H]
MIPI_CSI1_PDN2_H: D2.B7(GPIO4_B1_d) ; port MIPI_CSI1_CTRL.MIPI_CSI1_PDN2_H  [project net MIPI_CSI1_CTRL.MIPI_CSI1_PDN2_H]
mPCIE_GMAC1_RXCLK: D46.23(D3+B) ; port mPCIE_GMAC1.mPCIE_GMAC1_RXCLK  [project net mPCIE_GMAC1.mPCIE_GMAC1_RXCLK]
mPCIE_GMAC1_RXCTL: D46.40(SCL_B) ; port mPCIE_GMAC1.mPCIE_GMAC1_RXCTL  [project net mPCIE_GMAC1.mPCIE_GMAC1_RXCTL]
mPCIE_GMAC1_RXD0: D46.22(D3-B) ; port mPCIE_GMAC1.mPCIE_GMAC1_RXD0  [project net mPCIE_GMAC1.mPCIE_GMAC1_RXD0]
mPCIE_GMAC1_RXD1: D46.21(HPD_B) ; port mPCIE_GMAC1.mPCIE_GMAC1_RXD1  [project net mPCIE_GMAC1.mPCIE_GMAC1_RXD1]
mPCIE_GMAC1_RXD2: D46.20(CEC_B) ; port mPCIE_GMAC1.mPCIE_GMAC1_RXD2  [project net mPCIE_GMAC1.mPCIE_GMAC1_RXD2]
mPCIE_GMAC1_RXD3: D46.39(SDA_B) ; port mPCIE_GMAC1.mPCIE_GMAC1_RXD3  [project net mPCIE_GMAC1.mPCIE_GMAC1_RXD3]
mPCIE_GMAC1_TXCLK: D46.24(D2-B) ; port mPCIE_GMAC1.mPCIE_GMAC1_TXCLK  [project net mPCIE_GMAC1.mPCIE_GMAC1_TXCLK]
mPCIE_GMAC1_TXCTL: D46.29(D0+B) ; port mPCIE_GMAC1.mPCIE_GMAC1_TXCTL  [project net mPCIE_GMAC1.mPCIE_GMAC1_TXCTL]
mPCIE_GMAC1_TXD0: D46.25(D2+B) ; port mPCIE_GMAC1.mPCIE_GMAC1_TXD0  [project net mPCIE_GMAC1.mPCIE_GMAC1_TXD0]
mPCIE_GMAC1_TXD1: D46.26(D1-B) ; port mPCIE_GMAC1.mPCIE_GMAC1_TXD1  [project net mPCIE_GMAC1.mPCIE_GMAC1_TXD1]
mPCIE_GMAC1_TXD2: D46.27(D1+B) ; port mPCIE_GMAC1.mPCIE_GMAC1_TXD2  [project net mPCIE_GMAC1.mPCIE_GMAC1_TXD2]
mPCIE_GMAC1_TXD3: D46.28(D0-B) ; port mPCIE_GMAC1.mPCIE_GMAC1_TXD3  [project net mPCIE_GMAC1.mPCIE_GMAC1_TXD3]
PCIE20_PERSTn: D2.1E15(GPIO2_D7_d) ; port PCIE20_PERSTn.PCIE20_PERSTn
PCIE_GMAC1_RXCLK: D46.32(D3+A) ; port PCIE_GMAC1.PCIE_GMAC1_RXCLK  [project net PCIE_GMAC1.PCIE_GMAC1_RXCLK]
PCIE_GMAC1_RXCTL: D46.42(SCL_A) ; port PCIE_GMAC1.PCIE_GMAC1_RXCTL  [project net PCIE_GMAC1.PCIE_GMAC1_RXCTL]
PCIE_GMAC1_RXD0: D46.31(D3-A) ; port PCIE_GMAC1.PCIE_GMAC1_RXD0  [project net PCIE_GMAC1.PCIE_GMAC1_RXD0]
PCIE_GMAC1_RXD1: D46.19(HPD_A) ; port PCIE_GMAC1.PCIE_GMAC1_RXD1  [project net PCIE_GMAC1.PCIE_GMAC1_RXD1]
PCIE_GMAC1_RXD2: D46.18(CEC_A) ; port PCIE_GMAC1.PCIE_GMAC1_RXD2  [project net PCIE_GMAC1.PCIE_GMAC1_RXD2]
PCIE_GMAC1_RXD3: D46.41(SDA_A) ; port PCIE_GMAC1.PCIE_GMAC1_RXD3  [project net PCIE_GMAC1.PCIE_GMAC1_RXD3]
PCIE_GMAC1_TXCLK: D46.33(D2-A) ; port PCIE_GMAC1.PCIE_GMAC1_TXCLK  [project net PCIE_GMAC1.PCIE_GMAC1_TXCLK]
PCIE_GMAC1_TXCTL: D46.38(D0+A) ; port PCIE_GMAC1.PCIE_GMAC1_TXCTL  [project net PCIE_GMAC1.PCIE_GMAC1_TXCTL]
PCIE_GMAC1_TXD0: D46.34(D2+A) ; port PCIE_GMAC1.PCIE_GMAC1_TXD0  [project net PCIE_GMAC1.PCIE_GMAC1_TXD0]
PCIE_GMAC1_TXD1: D46.35(D1-A) ; port PCIE_GMAC1.PCIE_GMAC1_TXD1  [project net PCIE_GMAC1.PCIE_GMAC1_TXD1]
PCIE_GMAC1_TXD2: D46.36(D1+A) ; port PCIE_GMAC1.PCIE_GMAC1_TXD2  [project net PCIE_GMAC1.PCIE_GMAC1_TXD2]
PCIE_GMAC1_TXD3: D46.37(D0-A) ; port PCIE_GMAC1.PCIE_GMAC1_TXD3  [project net PCIE_GMAC1.PCIE_GMAC1_TXD3]
PCM_I2C_SCL: D2.1A4(GPIO4_B5_d) ; port DAC_CTRL.PCM_I2C_SCL  [project net DAC_CTRL.PCM_I2C_SCL]
PCM_I2C_SDA: D2.B8(GPIO4_B4_d) ; port DAC_CTRL.PCM_I2C_SDA  [project net DAC_CTRL.PCM_I2C_SDA]
PHY0_CLKOUT: D2.B14(GPIO3_B0_d) ; port GMAC0_CTRL.PHY0_CLKOUT
PHY0_MDC: D2.1A7(GPIO3_A6_d) ; port GMAC0_CTRL.PHY1_MDC
PHY0_MDIO: D2.A9(GPIO3_A5_d) ; port GMAC0_CTRL.PHY0_MDIO
PHY0_RSTn: D2.1C18(GPIO2_B5_d) ; port GMAC0_CTRL.PHY0_RSTn
PHY1_RSTn: D2.A19(GPIO2_B4_d) ; port GMAC1_MD.PHY1_RSTn  [project net GMAC1_MD.PHY1_RSTn]
Remote_ in: D2.1A19(GPIO3_A3_d) ; port IR_CTRL.Remote_ in  [project net IR_CTRL.Remote_ in]
Remote_out: D2.1A20(GPIO3_A2_d) ; port IR_CTRL.Remote_out  [project net IR_CTRL.Remote_out]
RK628_HDMIRX_INT_H: D2.1B12(GPIO4_A0_d) ; port RK628_CTRL.SAI4_LRCK_M0  [project net RK628_CTRL.SAI4_LRCK_M0]
RK628_HDMIRX_RST_L: D2.A21(GPIO2_B6_d) ; port RK628_CTRL.SAI4_SDI_M0  [project net RK628_CTRL.SAI4_SDI_M0]
RK628_I2C_SCL: D2.1D16(GPIO3_A0_d) R129.1 ; port RK628_SAI_I2C.RK628_I2C_SCL
RK628_I2C_SDA: D2.1B18(GPIO3_A1_d) R130.1 ; port RK628_SAI_I2C.RK628_I2C_SDA
RK_ASM_I2C_SCL: D2.1A24(GPIO1_D2_d) ; port ASM_I2C.RK_ASM_I2C_SCL  [project net ASM_I2C.RK_ASM_I2C_SCL]
RK_ASM_I2C_SDA: D2.C28(GPIO1_D3_d) ; port ASM_I2C.RK_ASM_I2C_SDA  [project net ASM_I2C.RK_ASM_I2C_SDA]
SAI4_LRCK_M0: D2.1B5(GPIO4_A6_d) ; port RK628_SAI_I2C.SAI4_LRCK_M0  [project net RK628_SAI_I2C.SAI4_LRCK_M0]
SAI4_SCLK_M0: D2.1C5(GPIO4_A4_d) ; port RK628_SAI_I2C.SAI4_SCLK_M0  [project net RK628_SAI_I2C.SAI4_SCLK_M0]
SAI4_SDI_M0: D2.1A5(GPIO4_B0_d) ; port RK628_SAI_I2C.SAI4_SDI_M0  [project net RK628_SAI_I2C.SAI4_SDI_M0]
SEL1_MUX_GMAC1: D46.16(SEL1) R440.1 R443.1 ; port MUX_GMAC1_CTRL.SEL1_MUX_GMAC1  [project net MUX_GMAC1_CTRL.SEL1_MUX_GMAC1]
SEL2_MUX_GMAC1: D46.17(SEL2) R441.1 R442.1 ; port MUX_GMAC1_CTRL.SEL2_MUX_GMAC1  [project net MUX_GMAC1_CTRL.SEL2_MUX_GMAC1]
WAKE_BT: D2.1E21(GPIO1_D4_d) ; port WL_BT_CTRL.WAKE_BT
WL_EN: D2.A26(GPIO1_C6_d) ; port WL_BT_CTRL.WL_EN  [project net WL_BT_CTRL.WL_EN]
WL_SDIO_CLK: D2.1B22(GPIO1_C1_d) ; port WL_SDIO.WL_SDIO_CLK  [project net WL_SDIO.WL_SDIO_CLK]
WL_SDIO_CMD: D2.B26(GPIO1_C0_d) ; port WL_SDIO.WL_SDIO_CMD  [project net WL_SDIO.WL_SDIO_CMD]
WL_SDIO_D0: D2.A28(GPIO1_B4_d) ; port WL_SDIO.WL_SDIO_D0  [project net WL_SDIO.WL_SDIO_D0]
WL_SDIO_D1: D2.B27(GPIO1_B5_d) ; port WL_SDIO.WL_SDIO_D1  [project net WL_SDIO.WL_SDIO_D1]
WL_SDIO_D2: D2.1A23(GPIO1_B6_d) ; port WL_SDIO.WL_SDIO_D2  [project net WL_SDIO.WL_SDIO_D2]
WL_SDIO_D3: D2.A27(GPIO1_B7_d) ; port WL_SDIO.WL_SDIO_D3  [project net WL_SDIO.WL_SDIO_D3]

Not connected (* = marked no-connect by the designer): D2 1A6(GPIO4_B3_d) 1C7(GPIO3_C7_d)* 1E22(GPIO1_D5_d)*; D46 9(NC)* 30(NC)*

### Layout directives
net class RGMII1: GMAC1_RXCLK, GMAC1_RXCLK_MUX, GMAC1_RXCTL, GMAC1_RXCTL_MUX, GMAC1_RXD0, GMAC1_RXD0_MUX, GMAC1_RXD1, GMAC1_RXD1_MUX, GMAC1_RXD2, GMAC1_RXD2_MUX, GMAC1_RXD3, GMAC1_RXD3_MUX, GMAC1_TXCLK_M0, GMAC1_TXCLK_MUX, GMAC1_TXCTL_M0, GMAC1_TXCTL_MUX, GMAC1_TXD0_M0, GMAC1_TXD0_MUX, GMAC1_TXD1_M0, GMAC1_TXD1_MUX, GMAC1_TXD2_M0, GMAC1_TXD2_MUX, GMAC1_TXD3_M0, GMAC1_TXD3_MUX
net class RGMII_PCIE: PCIE_GMAC1_RXCLK, PCIE_GMAC1_RXCTL, PCIE_GMAC1_RXD0, PCIE_GMAC1_RXD1, PCIE_GMAC1_RXD2, PCIE_GMAC1_RXD3, PCIE_GMAC1_TXCLK, PCIE_GMAC1_TXCTL, PCIE_GMAC1_TXD0, PCIE_GMAC1_TXD1, PCIE_GMAC1_TXD2, PCIE_GMAC1_TXD3
net class RGMII_mPCIe: mPCIE_GMAC1_RXCLK, mPCIE_GMAC1_RXCTL, mPCIE_GMAC1_RXD0, mPCIE_GMAC1_RXD1, mPCIE_GMAC1_RXD2, mPCIE_GMAC1_RXD3, mPCIE_GMAC1_TXCLK, mPCIE_GMAC1_TXCTL, mPCIE_GMAC1_TXD0, mPCIE_GMAC1_TXD1, mPCIE_GMAC1_TXD2, mPCIE_GMAC1_TXD3

### Notes on the sheet
- (near D46) ETH_MUX
- CPU_ETH
- (near R441) DNP
- (near R443) DNP
- Connection to MIPI_x2CSI
- Connection to CAN-FD
- Connection to CPU_ETH_RGMII1_SW
- Connection to AUDIO
- Connection to V-by-One
- Connection to RGMII0_ETH_PHY
- Connection to CPU_GPIO
- Connection to BMC
- Connection to Peripheral
- Подп. и дата
- Инв. № дубл.
- Взам. инв. №
- Инв. № подл.
- Изм.
- Лист
- № докум.
- Подп.
- Дата
- Копировал
- Формат А3
- (in symbol RK3576, part G) SoC
- (in symbol TS3DV642A0RUAR) MUX

### Library data of the parts
C541 = 0402-X7R-50V-0.1uF±10%: as C442 on sheet RGMII0_ETH_PHY; Dielectric: X7R; Case: C0402; Part Number: 0402-X7R-50V-0.1uF±10%; Value: 100nF; Tolerance: 10%; Temperature: -55°C~125°C; ComponentLink2Description: Link to datasheet; ComponentLink1Description: DATASHEET; ComponentLink2URL: https://www.lcsc.com/product-detail/Multilayer-Ceramic-Capacitors-MLCC-SMD-SMT_YAGEO-CC0402KRX7R9BB104_C131394.html; Last changed: 09.04.2025
C542 C544 = 0201-X5R-6.3V-1uF±20%: Manufacturer: Murata Electronics; NameFromManufacturer: GRM033R60J105MEA2D; Dielectric: X5R; Place: *); Tolerance: 20%; Check: False; Case: C0201; Part Number: 0201-X5R-6.3V-1uF±20%; Value: 1uF; Temperature: -55°C~85°C; ComponentLink2Description: Link to datasheet; ComponentLink1Description: DATASHEET; ComponentLink2URL: https://www.terraelectronica.ru/product/1209278; ComponentLink1URL: Datasheets/capacitors/GRM033R60J105MEA2-61A.pdf; Last changed: 27.10.2022
C543 C545 C546 = 0201-X5R-6.3V-0.1uF±10%: as C586 on sheet BMC; Case: C0201; Part Number: 0201-X5R-6.3V-0.1uF±10%; Value: 0.1uF; Temperature: -55°C~85°C; ComponentLink2Description: Link to datasheet; ComponentLink1Description: DATASHEET; ComponentLink2URL: https://www.terraelectronica.ru/product/1020032; ComponentLink1URL: Datasheets/capacitors/UPY-GPHC_X5R_4V-to-50V_27.pdf; Last changed: 27.10.2022
D2 = RK3576: SoC 4xCortex-A72@2.2Ghz+4xCortex-A53@2Ghz, LPDDR4/4X/5/5X, SDIO/eMMC/UFS/FSPI, BGA 16.1x17.2x1.0mm; Manufacturer: Rockship; Place: *); Check: False; Part Number: RK3576; Temperature: -40°C~85°C; Value: RK3576; ComponentLink1Description: DATASHEET; NameFromManufacturer: RK3576; ComponentLink1URL: https://wiki.friendlyelec.com/wiki/images/b/bf/Rockchip_RK3576_Datasheet_V1.5-20241216.pdf; Last changed: 06.01.2026
D46 = TS3DV642A0RUAR: 6-Gbps 12-channel differential 1-to-2 and 2-to-1 mux for DVI 1.0/ DisplayPort 1.4 /HDMI 2.0; Manufacturer: TI; Check: False; Part Number: TS3DV642A0RUAR; NameFromManufacturer: TS3DV642A0RUAR; Value: TS3DV642A0RUAR
R129 R130 = 0402-0.0625W-2.2K-100ppm±5%: as R286-R288 on sheet RGMII0_ETH_PHY; Case: R0402; Part Number: 0402-0.0625W-2.2K-100ppm±5%; Temperature: -55°C~155°C; ComponentLink1Description: DATASHEET; ComponentLink1URL: https://octopart.com/ac0402jr-072k2l-yageo-23514430?r=sp; Datasheet: Datasheets/resistors/PYu-AC_51_RoHS_L_8.pdf; Last changed: 27.10.2022
R423 = 0402-0.0625W-0R-100ppm±5%: NameFromManufacturer: RC0402JR-070RL; Manufacturer: Yageo; Place: *); Value: 0R; Tolerance: 5%; Check: False; Case: R0402; Part Number: 0402-0.0625W-0R-100ppm±5%; Temperature: -55°C~155°C; ComponentLink1Description: DATASHEET; ComponentLink1URL: https://ru.mouser.com/ProductDetail/YAGEO/RC0402JR-070RL?qs=%2Fha2pyFadugNN0LzwXn2qP7HsQ9BBU71VWxeSOFlFaYv9aVJHghTrg%3D%3D; Datasheet: Datasheets/resistors/PYu-RC_Group_51_RoHS_L_11.pdf; Last changed: 27.10.2022
R431-R437 R504-R509 = 0402-0.0625W-22R-100ppm±1%: as R294 on sheet RGMII0_ETH_PHY; Case: R0402; Part Number: 0402-0.0625W-22R-100ppm±1%; Tolerance: 1%; Temperature: -55°C~155°C; ComponentLink1Description: DATASHEET; ComponentLink1URL: https://www.yageo.com/upload/media/product/productsearch/datasheet/rchip/PYu-RC_Group_51_RoHS_L_11.pdf; Datasheet: Datasheets/resistors/PYu-RC_Group_51_RoHS_L_11.pdf; Last changed: 27.10.2022
R439-R443 = 0402-0.0625W-10K-100ppm±1%: as R264 on sheet BMC; Case: R0402; Part Number: 0402-0.0625W-10K-100ppm±1%; Tolerance: 1%; Temperature: -55°C~155°C; ComponentLink1Description: DATASHEET; ComponentLink1URL: https://ru.mouser.com/ProductDetail/YAGEO/RC0402FR-0710KL?qs=%2Fha2pyFaduhjtLcYvKXQ8IogF7YwN7YtH%252BOO8ZtEEMnoa4yoWYcwpw%3D%3D; Datasheet: Datasheets/resistors/PYu-RC_Group_51_RoHS_L_11.pdf; Last changed: 27.10.2022